# Altium schematic sheet MainBoard.SchDoc: Treble Boost
size A4; Author: Jeremiah Lilland; CompanyName: Pinebox Effects; DrawnBy: Jeremiah Lilland; Revision: 1.0; SheetNumber: 2; SheetTotal: 5; ProjectName: Booost
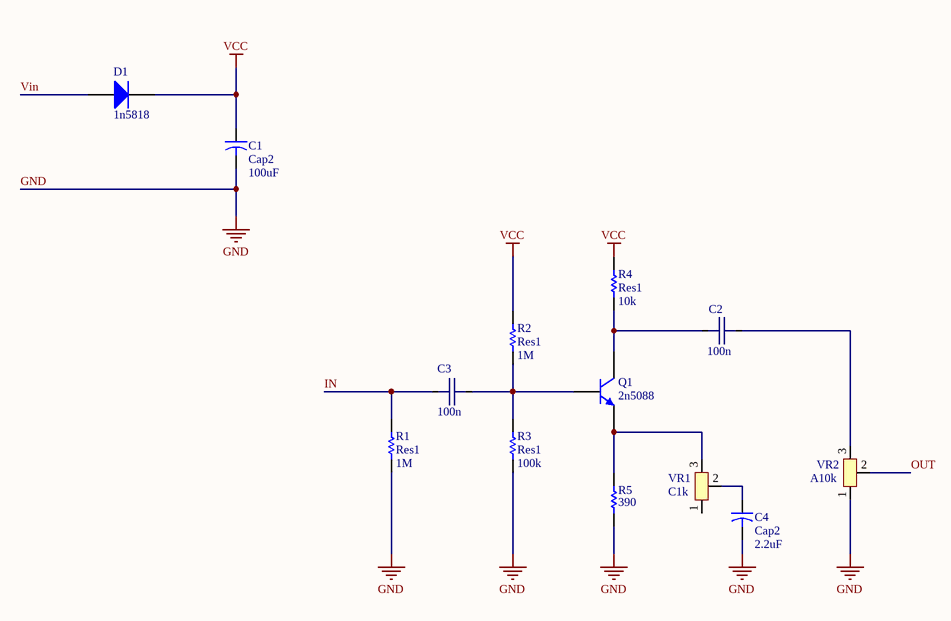
[diagram p0: MainBoard.SchDoc]

## Parts
C1  Cap2  value 100uF  [Cap - Electrolytic]
C2  value 100n  [Cap-0.2"]  (hidden comment: Wima Capacitor)
C3  value 100n  [Cap-0.2"]  (hidden comment: Wima Capacitor)
C4  Cap2  value 2.2uF  [Cap - Electrolytic]
D1  1n5818  [DO-35]
Q1  2n5088  [TO-226-AA]
R1  Res1  value 1M  [AXIAL-0.3]
R2  Res1  value 1M  [AXIAL-0.3]
R3  Res1  value 100k  [AXIAL-0.3]
R4  Res1  value 10k  [AXIAL-0.3]
R5  value 390  [AXIAL-0.3]  (hidden comment: Res1)
VR1  value C1k  [Pot-16mm]  (hidden comment: Pot-16mm)
VR2  value A10k  [Pot-16mm]  (hidden comment: Pot-16mm)

## Nets
GND: C1.2 C4.2 R1.1 R3.1 R5.1 VR2.1
VCC: C1.1 D1.2(K) R2.2 R4.2
IN: C3.1 R1.2
OUT: VR2.2
Vin: D1.1(A)
NetC2_1: C2.1 Q1.1(E) R4.1
NetC2_2: C2.2 VR2.3
NetC3_2: C3.2 Q1.2(B) R2.1 R3.2
NetC4_1: C4.1 VR1.2
NetQ1_3: Q1.3(C) R5.2 VR1.3

Not connected (* = marked no-connect by the designer): VR1 1

## Notes on the sheet
- Sheet Title:
- Project Title:
- Date:
- Revision:
- Sheet
- of
- File:

## Library data of the parts
C1 C4 = Cap2: Capacitor; Published: 23-Sep-2002; PackageReference: CAPR5-4X5; Publisher: Altium Limited; PackageDescription: Capacitor; 2 Leads
D1 = Diode 1N914: High Conductance Fast Diode; Published: 8-Jun-2000; LatestRevisionDate: 17-Jul-2002; LatestRevisionNote: Re-released for DXP Platform.; DatasheetVersion: 1997; PackageReference: DO-35; Publisher: Altium Limited; PackageDescription: Diode, Axial; Body 3.8 x 1.9 mm (LxDia. max), Lead Dia. 0.53 mm (max); Code_JEDEC: DO-204-AH; ComponentLink1Description: Manufacturer Link; ComponentLink1URL: http://www.fairchildsemi.com/; ComponentLink2Description: Datasheet; ComponentLink2URL: http://www.fairchildsemi.com/ds/1N%2F1N4448.pdf
Q1 = NPN: NPN Bipolar Transistor; pin to pad: 1>3 3>1; Published: 8-Jun-2000; LatestRevisionDate: 17-Jul-2002; LatestRevisionNote: Re-released for DXP Platform.; PackageReference: TO-226-AA; Publisher: Altium Limited; PackageDescription: TO, Flat Index; 3 In-Line, Axial Leads; Body Dia. 4.8mm; Leads 0.55 x 0.51 mm (max); Code_JEDEC: TO-226-AA
R1-R5 = Res1: Resistor; LatestRevisionDate: 17-Jul-2002; LatestRevisionNote: Re-released for DXP Platform.; PackageReference: AXIAL-0.3; Publisher: Altium Limited; PackageDescription: Axial Device, Thru-Hole; 2 Leads; 0.3 in Pin Spacing
  R1-R3 R5: Published: 8-Jun-2000